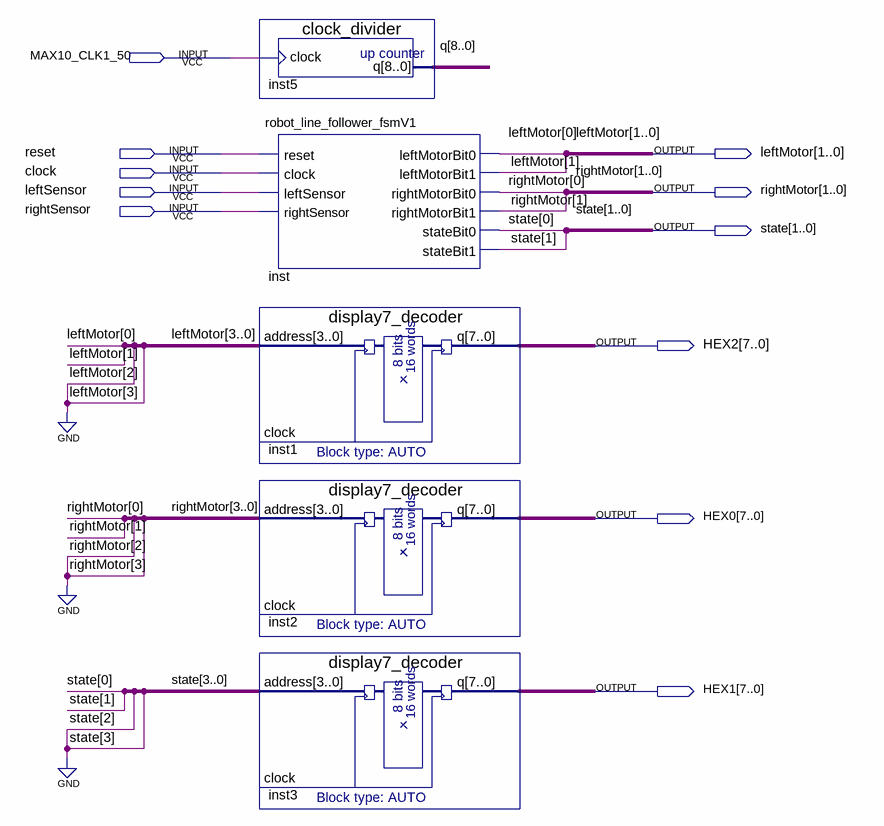
[diagram p0: schematic sheet]
// Quartus schematic block_diagram_V1.bdf as structural Verilog: 5 symbols, 11 pins
module block_diagram_V1 (
  input  MAX10_CLK1_50,
  input  reset,
  input  clock,
  input  leftSensor,
  input  rightSensor,
  output [1:0] leftMotor,
  output [1:0] rightMotor,
  output [1:0] state,
  output [7:0] HEX2,
  output [7:0] HEX0,
  output [7:0] HEX1
);

  wire [8:0] q;

  clock_divider inst5 (.clock(MAX10_CLK1_50), .q(q));
  robot_line_follower_fsmV1 inst (
    .reset(reset), .clock(clock), .leftSensor(leftSensor), .rightSensor(rightSensor),
    .leftMotorBit0(leftMotor[0]), .leftMotorBit1(leftMotor[1]), .rightMotorBit0(rightMotor[0]),
    .rightMotorBit1(rightMotor[1]), .stateBit0(state[0]), .stateBit1(state[1]));
  display7_decoder inst1 (.address({2'b00, leftMotor}), .q(HEX2));  // open: clock
  display7_decoder inst2 (.address({2'b00, rightMotor}), .q(HEX0));  // open: clock
  display7_decoder inst3 (.address({2'b00, state}), .q(HEX1));  // open: clock
endmodule
